# Altium schematic sheet BLE.SchDoc: =DocumentName
size 420 x 297 mm; CompanyName: "AS Manufacturing" LLC; Organization: "AS Manufacturing" LLC; Address1: 5 Sklyarenka St.; Address2: Kyiv 04073; Address3: Ukraine; Address4: https://ajax.systems/en/; DocumentNumber: 2; SheetNumber: 2; SheetTotal: 4; Template_version: 1.0.1
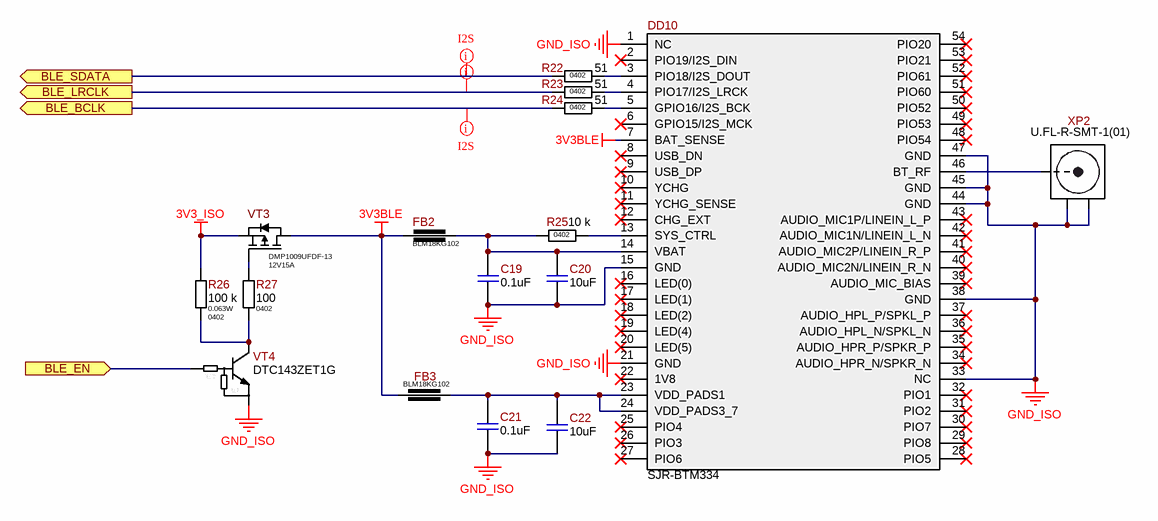
[diagram p0: BLE.SchDoc]

## Parts
C19  0.1uF  [C0402(1005)]
C20  10uF  [C0402(1005)]
C21  0.1uF  [C0402(1005)]
C22  10uF  [C0402(1005)]
DD10  SJR-BTM334  [BTM334]
FB2  BLM18KG102  [BLM18(0603)]
FB3  BLM18KG102  [BLM18(0603)]
R22  51  Package/Case: 0402  [R0402]
R23  51  Package/Case: 0402  [R0402]
R24  51  Package/Case: 0402  [R0402]
R25  10 k  Package/Case: 0402  [R0402]
R26  100 k  Power Rating: 0.063W  Package/Case: 0402  [R0402]
R27  100  Package/Case: 0402  [R0402]
VT3  DMP1009UFDF-13  Power Rating: 12V15A  [U-DFN2020-6_SLDR]
VT4  DTC143ZET1G  [SOT-416]
XP2  U.FL-R-SMT-1(01)  [IPEX_ RECE.20279.001E.01]

## Ports
BLE_BCLK (out), BLE_EN (in), BLE_LRCLK (out), BLE_SDATA (out)

## Nets
3V3_ISO: R26.1 VT3.S
3V3BLE: DD10.7(BAT_SENSE) FB2.1 FB3.1 VT3.D
GND_ISO: C19.1 C20.1 C21.2 C22.1 DD10.1(NC) DD10.15(GND) DD10.21(GND) DD10.33(NC) DD10.38(GND) DD10.44(GND) DD10.45(GND) DD10.47(GND) VT4.2(E) XP2.2 XP2.3
BLE_BCLK: R24.2 ; port BLE_BCLK
BLE_EN: VT4.1(B) ; port BLE_EN
BLE_LRCLK: R23.2 ; port BLE_LRCLK
BLE_SDATA: R22.2 ; port BLE_SDATA
NetC19_2: C19.2 C20.2 DD10.14(VBAT) FB2.2 R25.1
NetC21_1: C21.1 C22.2 DD10.23(VDD_PADS1) DD10.24(VDD_PADS3_7) FB3.2
NetDD10_3: DD10.3(PIO18/I2S_DOUT) R22.1
NetDD10_4: DD10.4(PIO17/I2S_LRCK) R23.1
NetDD10_5: DD10.5(GPIO16/I2S_BCK) R24.1
NetDD10_13: DD10.13(SYS_CTRL) R25.2
NetDD10_46: DD10.46(BT_RF) XP2.1
NetR26_2: R26.2 R27.1 VT4.3(C)
NetR27_2: R27.2 VT3.G

Not connected (* = marked no-connect by the designer): DD10 2(PIO19/I2S_DIN)* 6(GPIO15/I2S_MCK)* 8(USB_DN)* 9(USB_DP)* 10(YCHG)* 11(YCHG_SENSE)* 12(CHG_EXT)* 16(LED(0))* 17(LED(1))* 18(LED(2))* 19(LED(4))* 20(LED(5))* 22(1V8)* 25(PIO4)* 26(PIO3)* 27(PIO6)* 28(PIO5)* 29(PIO8)* 30(PIO7)* 31(PIO2)* 32(PIO1)* 34(AUDIO_HPR_N/SPKR_N)* 35(AUDIO_HPR_P/SPKR_P)* 36(AUDIO_HPL_N/SPKL_N)* 37(AUDIO_HPL_P/SPKL_P)* 39(AUDIO_MIC_BIAS)* 40(AUDIO_MIC2N/LINEIN_R_N)* 41(AUDIO_MIC2P/LINEIN_R_P)* 42(AUDIO_MIC1N/LINEIN_L_N)* 43(AUDIO_MIC1P/LINEIN_L_P)* 48(PIO54)* 49(PIO53)* 50(PIO52)* 51(PIO60)* 52(PIO61)* 53(PIO21)* 54(PIO20)*

## Layout directives
net class I2S1: BLE_BCLK, BLE_LRCLK, BLE_SDATA

## Notes on the sheet
- 1
- 2
- 3
- 4
- 5
- 6
- 7
- 8
- A
- B
- C
- D
- E
- F
- Назва проекту
- Мова
- UA
- Розробник
- Формат
- A3
- Версія
- Дата
- Лист
- /
- (in symbol DTC143ZET1G) 4.7k; 47k

## Library data of the parts
C19 C21 = 0.1uF  25V C0402: CAP CER 0.1UF 25V X7R 0402; Manufacturer: Samsung Electro-Mechanics; Name Component: Capacitor Ceramic; Tolerance: ±10%; Operation Temperature: -55°C ~ 125°C; Library Path 1: Capacitors.SchLib; Part Number: 0.1uF  25V C0402; Value: 0.1uF; Temperature Coefficient: X7R; Power (V/A): 25V; Package/Case: C0402; Supplier Part Number 1: 1276-6854-2-ND; ComponentLink1Description: Datasheet
C20 C22 = 10uF  6.3V C0402: CAP CER 10UF 6.3V X6S 0402; Manufacturer: Murata Electronics North America; Manufacturer P/N: GRM155C80J106ME11D; Name Component: Capacitor Ceramic; Tolerance: ±20%; Operation Temperature: -55°C ~ 105°C; Library Path 1: Capacitors.SchLib; Part Number: 10uF  6.3V C0402; Value: 10uF; Temperature Coefficient: X6S; Power (V/A): 6.3V; Package/Case: C0402; Supplier 1: Digi-key; Supplier Part Number 1: 490-13233-2-ND; ComponentLink1Description: Datasheet; ComponentLink1URL: https://www.murata.com/~/media/webrenewal/support/library/catalog/products/capacitor/mlcc/c02e.ashx?la=en-us
DD10 = SJR-BTM334: Bluetooth 5.1 audio module, QCC3034 chipset; Name Component: Bluetooth Module; Operation Temperature: -40°C ~ 85°C; Power (V/A): 2.8 ~ 34.3 V; Library Path 1: Module.SchLib; Part Number: SJR-BTM334; Value: SJR-BTM334; Package/Case: 13×18 mm; ComponentLink1Description: Datasheet; ComponentLink1URL: https://tianjiarun-1251103446.cos.ap-guangzhou.myqcloud.com/zb_users/upload/2020/04/SJR-BTM334_SPEC.pdf
FB2 FB3 = BLM18KG102: FERRITE BEAD 1 KOHM 0603 1LN; Manufacturer: Murata Electronics North America; Manufacturer P/N: BLM18KG102SN1D; Name Component: Ferrite Beads; Tolerance: ±25%; Power (V/A): 1A; Library Path 1: Inductance.SchLib; Part Number: BLM18KG102; Value: BLM18KG102; Package/Case: 0603 (1608 Metric); Supplier 1: Digi-key; Supplier Part Number 1: 490-17349-2-ND; ComponentLink1Description: Datasheet; ComponentLink1URL: https://media.digikey.com/pdf/Data%20Sheets/Murata%20PDFs/BLM18yyyyyyN1x.pdf
R22-R24 = 51  R0402: RES SMD 51 OHM  ±1% 1/16W 0402; Power Rating: 0.063W; Name Component: Resistror; Operation Temperature: -55℃ to 155℃; Temperature Coefficient: ±100 ppm/°C; Library Path 1: Resistor.SchLib; Part Number: 51  R0402; Value: 51; Tolerance: ±1%
R25 = 10 k  R0402: RES SMD 10 k OHM  ±1% 1/16W 0402; Power Rating: 0.063W; Name Component: Resistror; Operation Temperature: -55℃ to 155℃; Temperature Coefficient: ±100 ppm/°C; Library Path 1: Resistor.SchLib; Part Number: 10 k  R0402; Value: 10 k; Tolerance: ±1%
R26 = 100 k  R0402: RES SMD 100 k OHM  ±1% 1/16W 0402; Name Component: Resistror; Operation Temperature: -55℃ to 155℃; Temperature Coefficient: ±100 ppm/°C; Library Path 1: Resistor.SchLib; Part Number: 100 k  R0402; Value: 100 k; Tolerance: ±1%
R27 = 100  R0402: RES SMD 100 OHM  ±1% 1/16W 0402; Power Rating: 0.063W; Name Component: Resistror; Operation Temperature: -55℃ to 155℃; Temperature Coefficient: ±100 ppm/°C; Library Path 1: Resistor.SchLib; Part Number: 100  R0402; Value: 100; Tolerance: ±1%
VT3 = DMP1009UFDF-13: P-Channel 12 V 15A (Ta) 2W (Ta) Surface Mount U-DFN2020-6 (Type F); Manufacturer: Diodes Incorporated; Name Component: Transistor; Operation Temperature: -55°C ~ 150°C (TJ); Library Path 1: Transistors.SchLib; ComponentLink1URL: https://www.diodes.com/assets/Datasheets/DMP1009UFDF.pdf; ComponentLink1Description: Datasheet; Part Number: DMP1009UFDF-13; Value: DMP1009UFDF-13; Package/Case: U-DFN2020-6 (Type F); Manufacturer P/N: DMP1009UFDF-13; Supplier 1: Digi-key; Supplier Part Number 1: DMP1009UFDF-13-ND
VT4 = DTC143ZET1G: TRANS PREBIAS NPN 50V 100MA SC75; Manufacturer: onsemi; Name Component: Transistor; Operation Temperature: -55°C ~ 150°C (TJ); Power Rating: 100mA 50V; Library Path 1: Transistors.SchLib; Part Number: DTC143ZET1G; Value: DTC143ZET1G; Package/Case: SOT-416; Manufacturer P/N: DTC143ZET1G; Supplier 1: Digi-key; Supplier Part Number 1: DTC143ZET1GOSTR-ND; ComponentLink1Description: Datasheet; ComponentLink1URL: https://www.onsemi.com/pdf/datasheet/dtc143z-d.pdf
XP2 = U.FL-R-SMT-1(01): CONN UMC RCPT STR 50 OHM SMD; Manufacturer: HIROSE; Name Component: U.FL (IPX/AMC); Operation Temperature: -10°C …. 40°C; Library Path 1: Connectors.SchLib; Part Number: U.FL-R-SMT-1(01); Value: U.FL-R-SMT-1(01); Package/Case: Male Pin; Manufacturer P/N: U.FL-R-SMT-1(01); Supplier 1: TME; ComponentLink1Description: Datasheet; ComponentLink1URL: https://www.tme.eu/ua/ru/details/u.fl-r-smt-1-01/mikrorazemy/hirose/u-fl-r-smt-1-01/